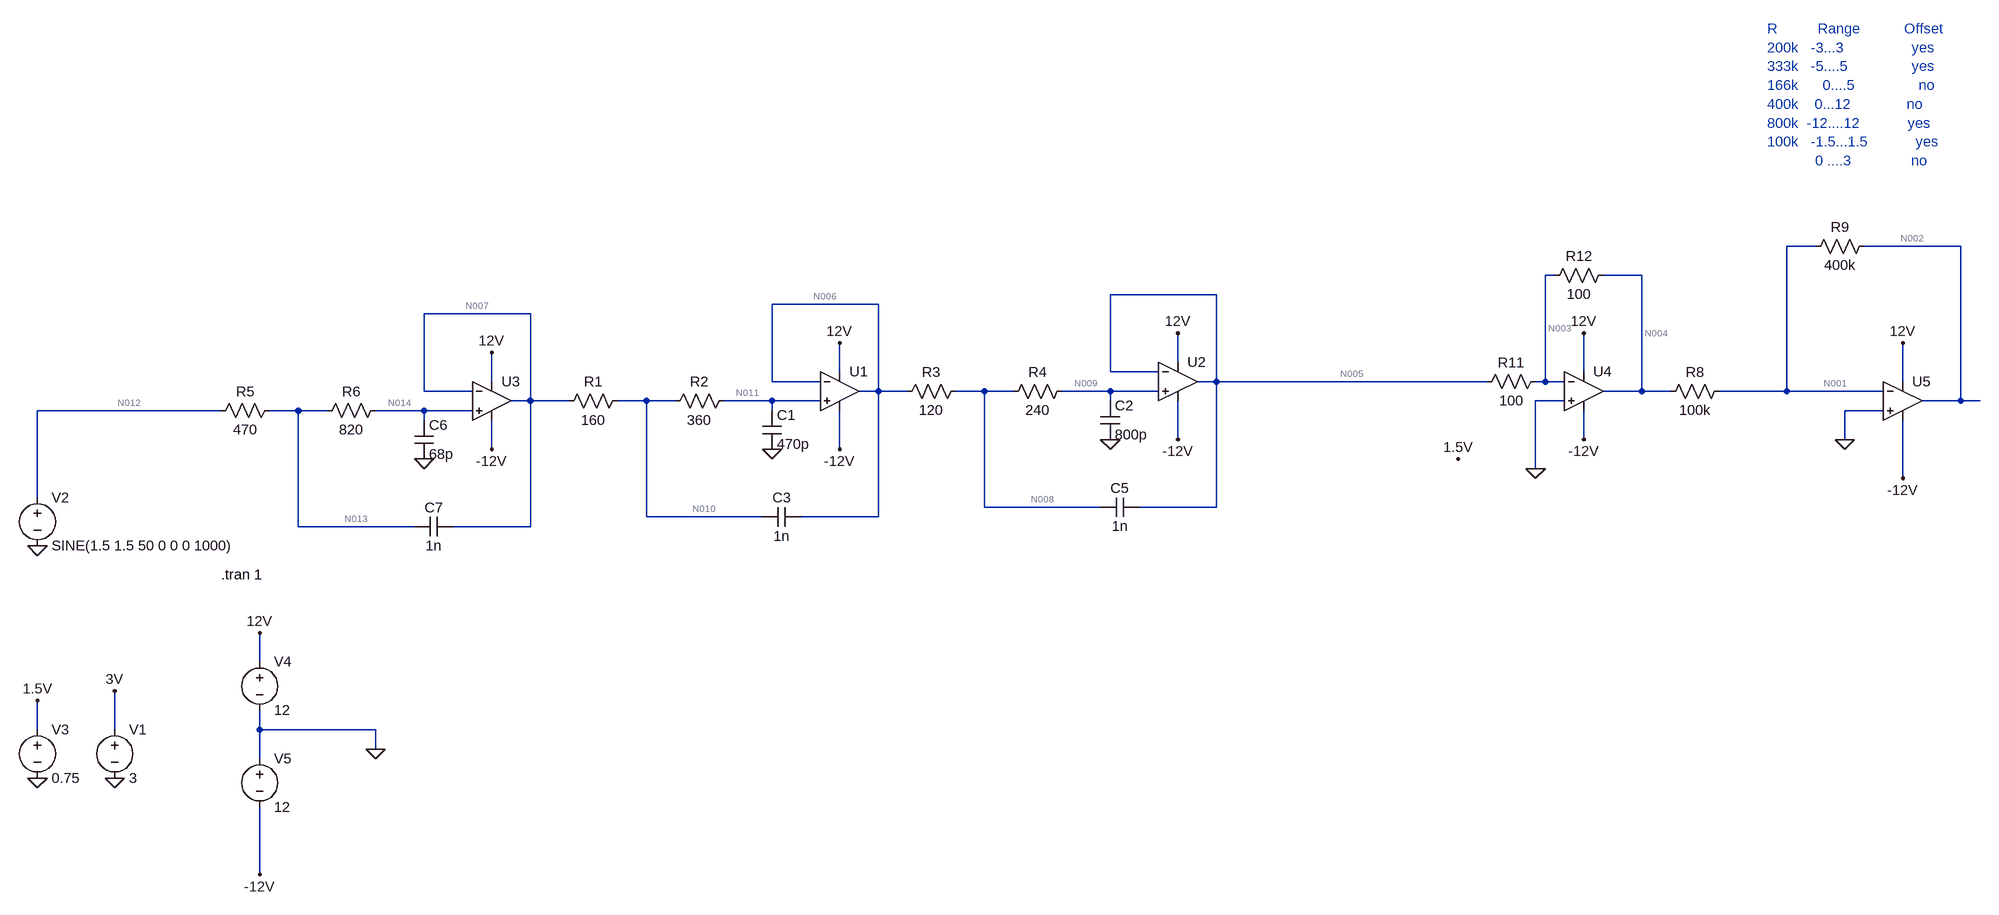
[diagram p0: schematic tp_reconstruction.asc]
tp_reconstruction.asc, the LTspice schematic file:
Version 4
SHEET 1 2216 996
WIRE 992 -144 944 -144
WIRE 1232 -144 1072 -144
WIRE 560 -96 544 -96
WIRE 704 -96 640 -96
WIRE 0 -64 -176 -64
WIRE -560 -48 -736 -48
WIRE -1136 -32 -1312 -32
WIRE -64 48 -64 0
WIRE -624 64 -624 16
WIRE -176 64 -176 -64
WIRE -96 64 -176 64
WIRE 608 64 608 0
WIRE -1200 80 -1200 32
WIRE -736 80 -736 -48
WIRE -656 80 -736 80
WIRE 0 80 0 -64
WIRE 0 80 -32 80
WIRE 448 80 0 80
WIRE 544 80 544 -96
WIRE 544 80 528 80
WIRE 576 80 544 80
WIRE 1136 80 1136 16
WIRE -1312 96 -1312 -32
WIRE -1232 96 -1312 96
WIRE -560 96 -560 -48
WIRE -560 96 -592 96
WIRE -512 96 -560 96
WIRE -384 96 -432 96
WIRE -336 96 -384 96
WIRE -176 96 -256 96
WIRE -96 96 -176 96
WIRE 704 96 704 -96
WIRE 704 96 640 96
WIRE 752 96 704 96
WIRE 944 96 944 -144
WIRE 944 96 832 96
WIRE 1104 96 944 96
WIRE -1136 112 -1136 -32
WIRE -1136 112 -1168 112
WIRE -1072 112 -1136 112
WIRE -944 112 -992 112
WIRE -896 112 -944 112
WIRE -736 112 -816 112
WIRE -656 112 -736 112
WIRE -176 112 -176 96
WIRE 576 112 528 112
WIRE 1232 112 1232 -144
WIRE 1232 112 1168 112
WIRE 1264 112 1232 112
WIRE -1648 128 -1952 128
WIRE -1520 128 -1568 128
WIRE -1472 128 -1520 128
WIRE -1312 128 -1392 128
WIRE -1232 128 -1312 128
WIRE -736 128 -736 112
WIRE 1104 128 1040 128
WIRE -1312 144 -1312 128
WIRE -64 176 -64 112
WIRE 608 176 608 128
WIRE 1040 176 1040 128
WIRE -1200 192 -1200 144
WIRE -624 192 -624 128
WIRE 528 224 528 112
WIRE 1136 240 1136 144
WIRE -1952 272 -1952 128
WIRE -384 288 -384 96
WIRE -192 288 -384 288
WIRE 0 288 0 80
WIRE 0 288 -128 288
WIRE -944 304 -944 112
WIRE -752 304 -944 304
WIRE -560 304 -560 96
WIRE -560 304 -688 304
WIRE -1520 320 -1520 128
WIRE -1328 320 -1520 320
WIRE -1136 320 -1136 112
WIRE -1136 320 -1264 320
WIRE -1584 544 -1584 496
WIRE -1952 656 -1952 608
WIRE -1824 656 -1824 592
WIRE -1584 656 -1584 624
WIRE -1392 656 -1584 656
WIRE -1392 688 -1392 656
WIRE -1584 704 -1584 656
WIRE -1584 896 -1584 784
FLAG -736 192 0
FLAG -1824 736 0
FLAG -1824 592 3V
FLAG -1952 352 0
FLAG -1952 736 0
FLAG -1952 608 1.5V
FLAG -176 176 0
FLAG -1312 208 0
FLAG 400 208 1.5V
FLAG -1392 688 0
FLAG -1584 496 12V
FLAG 1136 16 12V
FLAG -1584 896 -12V
FLAG 1136 240 -12V
FLAG 1040 176 0
FLAG 608 176 -12V
FLAG 608 0 12V
FLAG -1200 32 12V
FLAG -624 16 12V
FLAG -64 0 12V
FLAG -1200 192 -12V
FLAG -624 192 -12V
FLAG -64 176 -12V
FLAG 528 224 0
SYMBOL Opamps\\UniversalOpAmp -624 96 R0
SYMATTR InstName U1
SYMBOL res -976 96 R90
WINDOW 0 0 56 VBottom 2
WINDOW 3 32 56 VTop 2
SYMATTR InstName R1
SYMATTR Value 160
SYMBOL res -800 96 R90
WINDOW 0 0 56 VBottom 2
WINDOW 3 32 56 VTop 2
SYMATTR InstName R2
SYMATTR Value 360
SYMBOL cap -752 128 R0
SYMATTR InstName C1
SYMATTR Value 470p
SYMBOL cap -688 288 R90
WINDOW 0 0 32 VBottom 2
WINDOW 3 32 32 VTop 2
SYMATTR InstName C3
SYMATTR Value 1n
SYMBOL voltage -1824 640 R0
WINDOW 123 0 0 Left 0
WINDOW 39 0 0 Left 0
SYMATTR InstName V1
SYMATTR Value 3
SYMBOL voltage -1952 256 R0
WINDOW 123 24 124 Left 2
WINDOW 39 0 0 Left 0
SYMATTR InstName V2
SYMATTR Value SINE(1.5 1.5 50 0 0 0 1000)
SYMBOL voltage -1952 640 R0
WINDOW 123 0 0 Left 0
WINDOW 39 0 0 Left 0
SYMATTR InstName V3
SYMATTR Value 0.75
SYMBOL Opamps\\UniversalOpAmp -64 80 R0
SYMATTR InstName U2
SYMBOL res -416 80 R90
WINDOW 0 0 56 VBottom 2
WINDOW 3 32 56 VTop 2
SYMATTR InstName R3
SYMATTR Value 120
SYMBOL res -240 80 R90
WINDOW 0 0 56 VBottom 2
WINDOW 3 32 56 VTop 2
SYMATTR InstName R4
SYMATTR Value 240
SYMBOL cap -192 112 R0
SYMATTR InstName C2
SYMATTR Value 800p
SYMBOL cap -128 272 R90
WINDOW 0 0 32 VBottom 2
WINDOW 3 32 32 VTop 2
SYMATTR InstName C5
SYMATTR Value 1n
SYMBOL Opamps\\UniversalOpAmp -1200 112 R0
SYMATTR InstName U3
SYMBOL res -1552 112 R90
WINDOW 0 0 56 VBottom 2
WINDOW 3 32 56 VTop 2
SYMATTR InstName R5
SYMATTR Value 470
SYMBOL res -1376 112 R90
WINDOW 0 0 56 VBottom 2
WINDOW 3 32 56 VTop 2
SYMATTR InstName R6
SYMATTR Value 820
SYMBOL cap -1328 144 R0
SYMATTR InstName C6
SYMATTR Value 68p
SYMBOL cap -1264 304 R90
WINDOW 0 0 32 VBottom 2
WINDOW 3 32 32 VTop 2
SYMATTR InstName C7
SYMATTR Value 1n
SYMBOL Opamps\\UniversalOpAmp 608 96 R0
SYMATTR InstName U4
SYMBOL voltage -1584 528 R0
WINDOW 123 0 0 Left 0
WINDOW 39 0 0 Left 0
SYMATTR InstName V4
SYMATTR Value 12
SYMBOL voltage -1584 688 R0
WINDOW 123 0 0 Left 0
WINDOW 39 0 0 Left 0
SYMATTR InstName V5
SYMATTR Value 12
SYMBOL Opamps\\UniversalOpAmp 1136 112 R0
SYMATTR InstName U5
SYMBOL res 848 80 R90
WINDOW 0 0 56 VBottom 2
WINDOW 3 32 56 VTop 2
SYMATTR InstName R8
SYMATTR Value 100k
SYMBOL res 544 64 R90
WINDOW 0 0 56 VBottom 2
WINDOW 3 32 56 VTop 2
SYMATTR InstName R11
SYMATTR Value 100
SYMBOL res 656 -112 R90
WINDOW 0 0 56 VBottom 2
WINDOW 3 32 56 VTop 2
SYMATTR InstName R12
SYMATTR Value 100
SYMBOL res 1088 -160 R90
WINDOW 0 0 56 VBottom 2
WINDOW 3 32 56 VTop 2
SYMATTR InstName R9
SYMATTR Value 400k
TEXT -1648 400 Left 2 !.tran 1
TEXT 912 -504 Left 2 ;R          Range           Offset\n200k   -3...3                 yes\n333k   -5....5                yes\n166k      0....5                no\n400k    0...12              no\n800k  -12....12            yes\n100k   -1.5...1.5            yes\n            0 ....3               no

The netlist it stands for:
* tp_reconstruction.asc
XU1 N011 N006 12V -12V N006 level1 Avol=1Meg GBW=10Meg Vos=0 En=0 Enk=0 In=0 Ink=0 Rin=500Meg  ; pins In+ In- V+ V- OUT
R1 N010 N007 160
R2 N011 N010 360
C1 N011 0 470p
C3 N006 N010 1n
V1 3V 0 3
V2 N012 0 SINE(1.5 1.5 50 0 0 0 1000)
V3 1.5V 0 0.75
XU2 N009 N005 12V -12V N005 level1 Avol=1Meg GBW=10Meg Vos=0 En=0 Enk=0 In=0 Ink=0 Rin=500Meg  ; pins In+ In- V+ V- OUT
R3 N008 N006 120
R4 N009 N008 240
C2 N009 0 800p
C5 N005 N008 1n
XU3 N014 N007 12V -12V N007 level1 Avol=1Meg GBW=10Meg Vos=0 En=0 Enk=0 In=0 Ink=0 Rin=500Meg  ; pins In+ In- V+ V- OUT
R5 N013 N012 470
R6 N014 N013 820
C6 N014 0 68p
C7 N007 N013 1n
XU4 0 N003 12V -12V N004 level1 Avol=1Meg GBW=10Meg Vos=0 En=0 Enk=0 In=0 Ink=0 Rin=500Meg  ; pins In+ In- V+ V- OUT
V4 12V 0 12
V5 0 -12V 12
XU5 0 N001 12V -12V N002 level1 Avol=1Meg GBW=10Meg Vos=0 En=0 Enk=0 In=0 Ink=0 Rin=500Meg  ; pins In+ In- V+ V- OUT
R8 N001 N004 100k
R11 N003 N005 100
R12 N004 N003 100
R9 N002 N001 400k
.tran 1
* R          Range           Offset
* 200k   -3...3                 yes
* 333k   -5....5                yes
* 166k      0....5                no
* 400k    0...12              no
* 800k  -12....12            yes
* 100k   -1.5...1.5            yes
*             0 ....3               no
.lib UniversalOpAmp1.lib
.backanno
.end

* Results of the author's LTspice run, read from the files saved beside the schematic
* Operating Point, zero values left out:
*   V(n006) = 1.5 V
*   V(n011) = 1.5 V
*   V(12v) = 12 V
*   V(-12v) = -12 V
*   V(n010) = 1.5 V
*   V(n007) = 1.5 V
*   V(3v) = 3 V
*   V(n012) = 1.5 V
*   V(1.5v) = 750 mV
*   V(n005) = 1.5 V
*   V(n009) = 1.5 V
*   V(n008) = 1.5 V
*   V(n014) = 1.5 V
*   V(n013) = 1.5 V
*   V(n003) = 1.501 µV
*   V(n004) = -1.5 V
*   V(n001) = -6 µV
*   V(n002) = 6 V
*   I(R9) = 15 µA
*   I(R12) = -15 mA
*   I(R11) = -15 mA
*   I(R8) = 15 µA
*   I(R6) = -3 nA
*   I(R5) = -3 nA
*   I(R4) = -3 nA
*   I(R3) = -3 nA
*   I(R2) = -3 nA
*   I(R1) = -3 nA
*   I(V5) = -129 nA
*   I(V4) = -111 nA
*   I(V2) = -3 nA
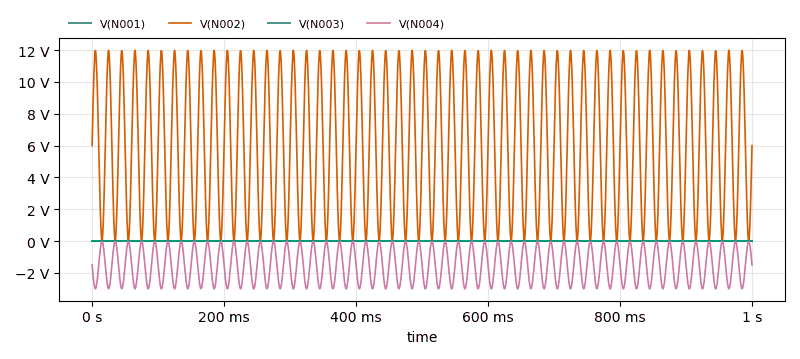
[diagram p1: Transient Analysis of tp_reconstruction.asc, plotted from the saved traces]
* Transient Analysis, 1 run:
*   V(N001): min -41.4 µV, max 24.07 µV, average -5.999 µV, rms 22.09 µV, last -35.81 µV
*   V(N002): min 18.03 mV, max 11.98 V, average 5.999 V, rms 7.321 V, last 5.998 V
*   V(N003): min -6.017 µV, max 10.55 µV, average 1.501 µV, rms 5.523 µV, last 8.951 µV
*   V(N004): min -2.996 V, max -4.506 mV, average -1.5 V, rms 1.83 V, last -1.5 V